# EAGLE design EVAL_51296 (EAGLE 7.7.0)
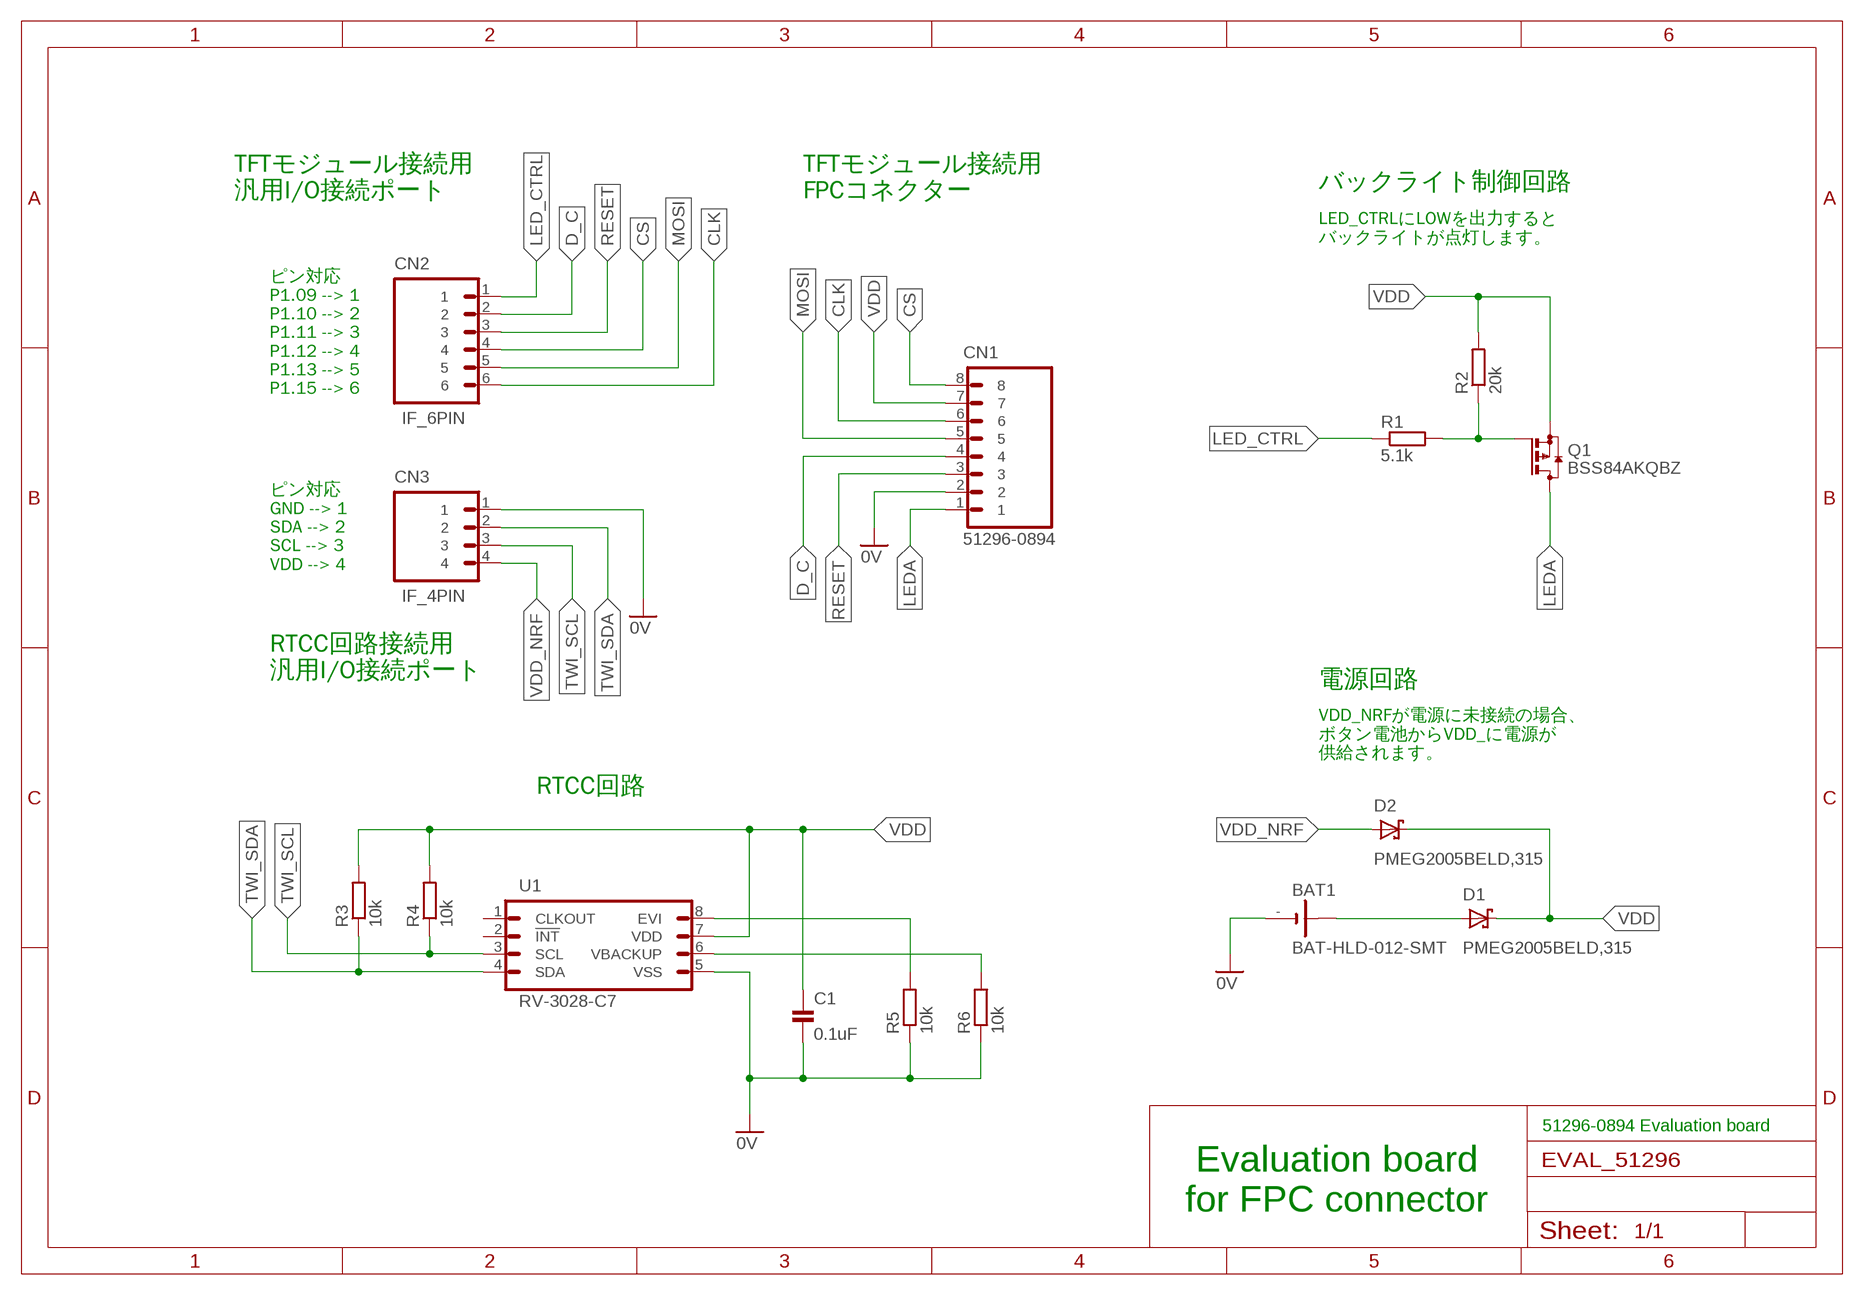
[diagram p0: schematic, sheet 1]

## Parts
BAT1  BAT-HLD-012-SMT  [BAT-HLD-012-SMT]
C1  0.1uF  CAP_0402N  [C0402N]
CN1  51296-0894  [51296-0894]
CN2  IF_6PIN  [HEADER_6PIN]
CN3  IF_4PIN  [HEADER_4PIN]
D1  PMEG2005BELD,315  [DFN1006D-2]
D2  PMEG2005BELD,315  [DFN1006D-2]
Q1  BSS84AKQBZ  [BSS84AKQB]
R1  5.1k  RESISTOR_0402N  [R0402N]
R2  20k  RESISTOR_0402N  [R0402N]
R3  10k  RESISTOR_0402N  [R0402N]
R4  10k  RESISTOR_0402N  [R0402N]
R5  10k  RESISTOR_0402N  [R0402N]
R6  10k  RESISTOR_0402N  [R0402N]
U1  RV-3028-C7  [SON-8]

## Nets
0V: BAT1.- C1.2 CN1.2 CN3.1 R5.1 R6.1 U1.5(VSS)
CLK: CN1.6 CN2.6
CS: CN1.8 CN2.4
D_C: CN1.4 CN2.2
LED_CTRL: CN2.1 R1.1
LEDA: CN1.1 Q1.3(D)
MOSI: CN1.5 CN2.5
N$1: Q1.1(G) R1.2 R2.1
N$2: BAT1.+@2(+) D1.2(A)
N$9: R6.2 U1.6(VBACKUP)
N$10: R5.2 U1.8(EVI)
RESET: CN1.3 CN2.3
TWI_SCL: CN3.3 R4.1 U1.3(SCL)
TWI_SDA: CN3.2 R3.1 U1.4(SDA)
VDD: C1.1 CN1.7 D1.1(C) D2.1(C) Q1.2(S) R2.2 R3.2 R4.2 U1.7(VDD)
VDD_NRF: CN3.4 D2.2(A)
Unconnected: U1.1(CLKOUT) U1.2(!INT!)

## Notes on the sheet
- TFTモジュール接続用
  汎用I/O接続ポート
- TFTモジュール接続用
  FPCコネクター
- バックライト制御回路
- LED_CTRLにLOWを出力すると
  バックライトが点灯します。
- ピン対応
  P1.09 --> 1
  P1.10 --> 2
  P1.11 --> 3
  P1.12 --> 4
  P1.13 --> 5
  P1.15 --> 6
- ピン対応
  GND --> 1
  SDA --> 2
  SCL --> 3
  VDD --> 4
- RTCC回路接続用
  汎用I/O接続ポート
- 電源回路
- VDD_NRFが電源に未接続の場合、
  ボタン電池からVDD_に電源が
  供給されます。
- RTCC回路
- 51296-0894 Evaluation board
- Evaluation board
  for FPC connector

## Library data of the parts
BAT1 = Connectors:BAT-HLD-012-SMT: ボタン電池ホルダー(CR1216/1225)
C1 = Parts:CAP: コンデンサー
CN1 = Connectors:51296-0894: 0.5mm-8pins FFC & FPC Connector Right Angle, Bottom Contact
CN2 = Connectors:IF_6PIN: 6-pin インターフェース
CN3 = Connectors:IF_4PIN: 4-pin インターフェース
D1 D2 = Parts:PMEG2005: ショットキーダイオード If - 順電流: 500 mA Vrrm - 繰返し逆電圧: 20 V Vf - 順電圧: 0.39 V Ifsm - 順方向サージ電流: 10 A 最低動作温度: - 65 C 最高動作温度: + 150 C
Q1 = Parts:BSS84AKQB: P-Channel MOSFET DFN-1110D-3
R1-R6 = Parts:RESISTOR: 抵抗器
U1 = ICs:RV-3028-C7: Extreme Low Power RTC Module Supply Voltage: 1.2 V 〜 5.5 V Operating Temperature: - 40 C 〜 + 85 C 3.2 mm x 1.5 mm

## Board
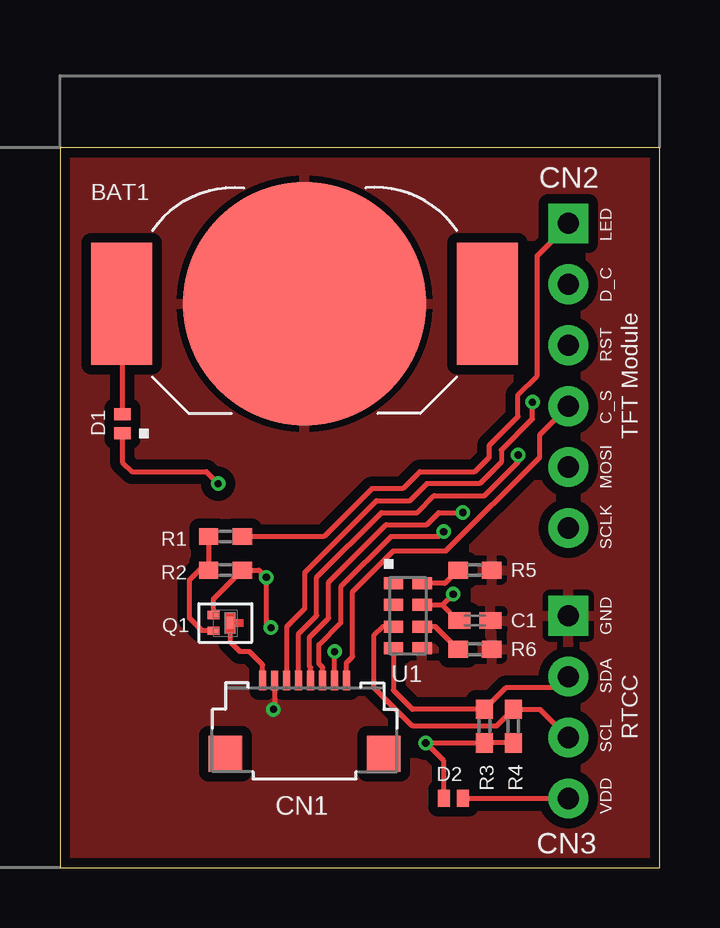
[diagram p1: board, top side]
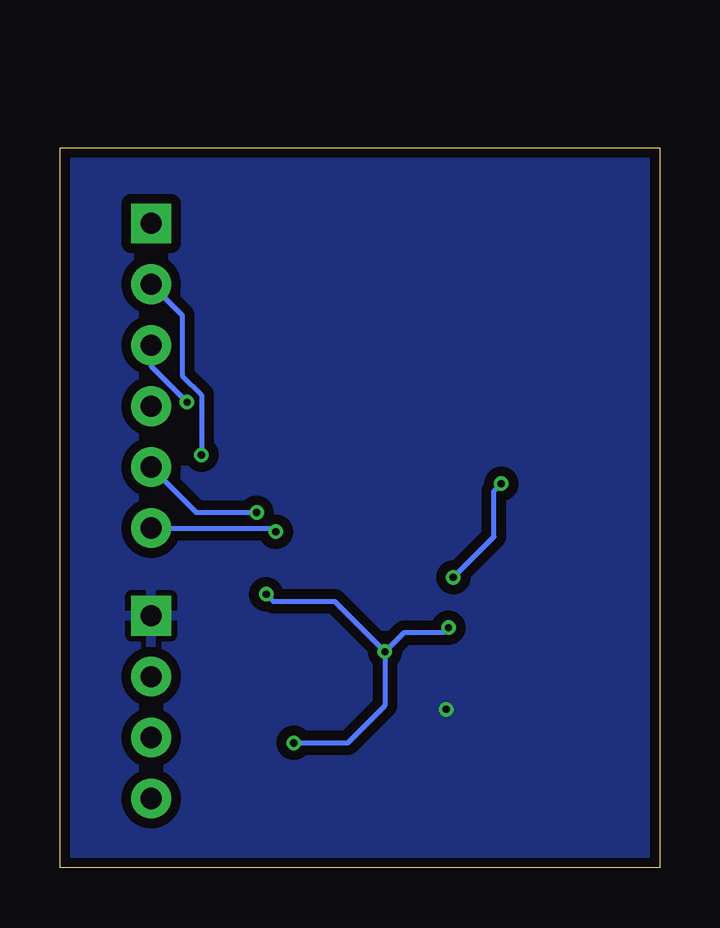
[diagram p2: board, bottom side, seen from below]

Size 25 x 30 mm. Coordinates in mm from the lower left corner, seen from the top.
Outline: 0,0 25,0 25,30 0,30 0,0
Copper layers (1*16): Top 0.035mm / dielectric 1.5mm / Bottom 0.035mm
Design rules "SeeedStudio_2layer_DRU_no_angle_20140221 *": minimum track width 6mil, minimum drill 0.3mm, track to track 6mil, track to pad 6mil, pad to pad 6mil, via to via 6mil, smd to smd 0mil, copper to edge 10mil, drill to drill 10mil, minimum pad ring 10mil, minimum via ring 6mil, stop-mask expansion 2mil, vias tented up to drill 100mil, thermal gap 10mil

### Footprints (pad centres in the part's own frame; a part is rotated, then mirrored left to right if it is on the bottom)
BAT-HLD-012-SMT = smd 2.54 x 5.08: +@1 -7.62,0; +@2 7.62,0 | smd 10.16 x 10.16: - 0,0
C0402N = smd 0.925 x 0.7: 1 -0.65,0; 2 0.65,0
51296-0894 = smd 0.28 x 0.8: 1 -1.75,3.8; 2 -1.25,3.8; 3 -0.75,3.8; 4 -0.25,3.8; 5 0.25,3.8; 6 0.75,3.8; 7 1.25,3.8; 8 1.75,3.8 | smd 1.4 x 1.5: FG1 -3.3,0.75; FG2 3.3,0.75
HEADER_6PIN = drill 0.889 pad 1.651 square: 1 -6.35,0 | drill 0.889 pad 1.651: 2 -3.81,0; 3 -1.27,0; 4 1.27,0; 5 3.81,0; 6 6.35,0
HEADER_4PIN = drill 0.889 pad 1.651 square: 1 0,0 | drill 0.889 pad 1.651: 2 2.54,0; 3 5.08,0; 4 7.62,0
DFN1006D-2 = smd 0.5 x 0.7: 1 -0.4,0; 2 0.4,0
BSS84AKQB = smd 0.35 x 0.5: 1 -0.325,0.5; 2 0.325,0.5 | smd 0.5 x 0.3: 3 0,-0.19
R0402N = smd 0.8 x 0.7: 1 -0.7,0; 2 0.7,0
SON-8 = smd 0.5 x 0.8: 1 0.25,0.4; 2 1.15,0.4; 3 2.05,0.4; 4 2.95,0.4; 5 2.95,1.6; 6 2.05,1.6; 7 1.15,1.6; 8 0.25,1.6

### Placement (x,y rotation side)
BAT1  10.2,23.5 180 top
C1  17.3,10.3 0 top
CN1  10.2,4 0 top
CN2  21.2,20.5 270 top
CN3  21.2,10.5 270 top
D1  2.6,18.5 90 top
D2  16.4,2.9 0 top
Q1  6.9,10.2 90 top
R1  6.9,13.8 180 top
R2  6.9,12.4 0 top
R3  17.7,5.9 270 top
R4  18.9,5.9 270 top
R5  17.3,12.4 180 top
R6  17.3,9.1 180 top
U1  13.5,12.1 270 top

### Tracks (layer width: path | path; a pad name or v marks a point on that pad's centre or on a via)
0V  (via drill 0.3)
  Top 0.203: CN1.2 8.95,6.65 v8.9,6.6
  pour Top (isolate 0.406, rank 3): -1,31 26,31 26,-1 -1,-1
  pour Bottom (isolate 0.406, rank 3): -2,32 27,32 27,-2 -2,-2
CLK  (via drill 0.3)
  Top 0.203: v16,14 15.8,13.8 13.8,13.8 11.7,11.7 11.7,10.2 10.8,9.3 10.8,8.5 10.95,8.35 CN1.6
  Bottom 0.203: CN2.6 16.15,14.15 v16,14
CS
  Top 0.203: CN1.8 11.95,8.55 12.2,8.8 12.2,11.5 13.9,13.2 16.1,13.2 20,17.1 20,18.03 CN2.4
D_C  (via drill 0.3)
  Top 0.203: CN1.4 9.95,9.75 10.7,10.5 10.7,12.1 13.4,14.8 14.9,14.8 15.6,15.5 17.7,15.5 19.1,16.9 v19.1,17.2
  Bottom 0.203: CN2.2 19.9,23.01 19.9,20.5 19.1,19.7 v19.1,17.2
LED_CTRL
  Top 0.203: R1.1 11,13.8 13,15.8 14.3,15.8 15,16.5 17.3,16.5 17.9,17.1 17.9,17.6 19.1,18.8 19.1,19.7 19.9,20.5 19.9,25.5 21.2,26.8 CN2.1
LEDA
  Top 0.203: CN1.1 8.45,8.45 7.9,9 7.5,9 7.09,9.41 Q1.3
MOSI  (via drill 0.3)
  Top 0.203: CN1.5 10.45,8.35 10.4,8.4 10.4,9.6 11.2,10.4 11.2,11.9 13.6,14.3 15.3,14.3 15.8,14.8 v16.8,14.8
  Bottom 0.203: v16.8,14.8 19.31,14.8 CN2.5
N$1
  Top 0.203: R1.2 R2.1 5.8,12.4 5.4,12 5.4,10.4 5.92,9.88 Q1.1
N$2
  Top 0.203: BAT1.+@2 2.6,23.48 D1.2
N$9
  Top 0.203: R6.2 15.65,10.05 U1.6
N$10
  Top 0.203: R5.2 16.05,11.85 U1.8
RESET  (via drill 0.3)
  Top 0.203: CN1.3 9.45,10.05 10.2,10.8 10.2,12.3 13.2,15.3 14.6,15.3 15.3,16 17.5,16 18.4,16.9 18.4,17.4 19.7,18.7 v19.7,19.4
  Bottom 0.203: CN2.3 21.2,20.9 v19.7,19.4
TWI_SCL
  Top 0.203: CN3.3 20.02,6.6 R4.1 18.2,5.9 14.7,5.9 13.1,7.5 13.1,9.7 13.45,10.05 U1.3
TWI_SDA
  Top 0.203: U1.4 13.9,7.4 14.7,6.6 R3.1 18.6,7.5 20.74,7.5 CN3.2
VDD  (via drill 0.3)
  Top 0.203: v8.6,12.1 8.4,12.2 | v8.6,12.1 8.3,12.4 R2.2 6.4,11.2 Q1.2 | CN1.7 v11.45,9 | R4.2 R3.2 v15.25,5.2 16,4.45 D2.1 | U1.7 15.95,10.95 | 15.95,10.95 v16.4,11.4 | C1.1 16.6,10.3 15.95,10.95 | D1.1 2.6,16.9 3,16.5 6.1,16.5 v6.6,16 | v8.6,12.1 8.6,10.2 v8.8,10
  Bottom 0.203: v8.6,12.1 6.9,13.8 6.9,15.7 v6.6,16 | v11.45,9 10.65,9.8 9,9.8 v8.8,10 | v15.25,5.2 13,5.2 11.45,6.75 v11.45,9 | v16.4,11.4 16.1,11.1 13.55,11.1 v11.45,9
VDD_NRF
  Top 0.203: CN3.4 16.82,2.88 D2.2

### Text on the board
tPlace: LED | D_C | RST | TFT Module | C_S | MOSI | SCLK | GND | SDA | RTCC | SCL | VDD